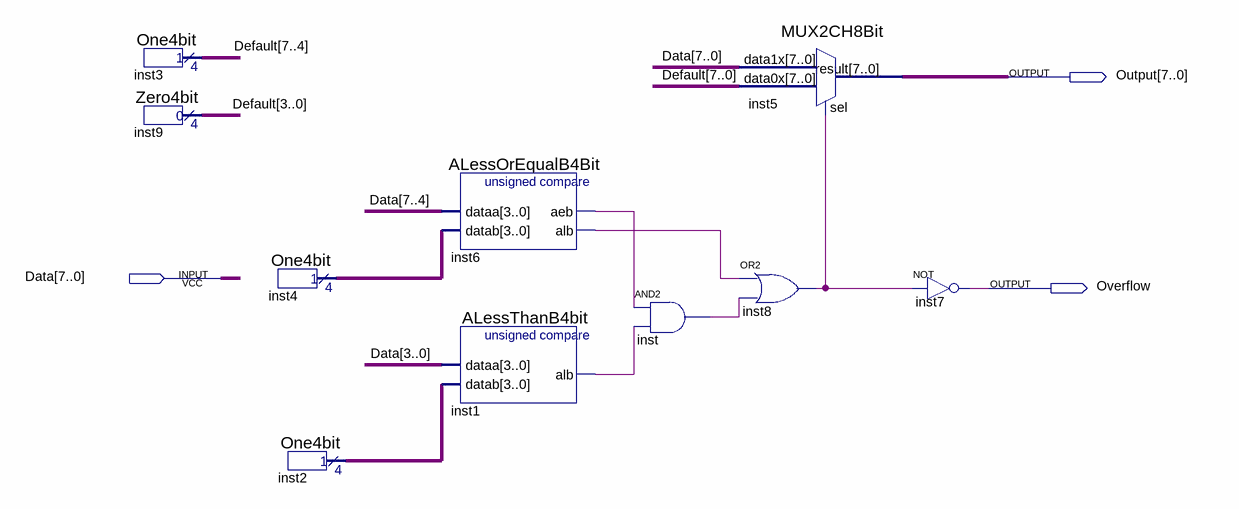
[diagram p0: schematic sheet]
// Quartus schematic FireValueLimit.bdf as structural Verilog: 10 symbols, 3 pins
module FireValueLimit (
  input  [7:0] Data,
  output [7:0] Output,
  output Overflow
);

  wire inst1_alb, inst6_aeb, inst6_alb, inst8_out, inst_out;
  wire [3:0] inst2_result, inst4_result;
  wire [7:0] Default;

  One4bit inst3 (.result(Default[7:4]));
  Zero4bit inst9 (.result(Default[3:0]));
  One4bit inst4 (.result(inst4_result));
  One4bit inst2 (.result(inst2_result));
  ALessOrEqualB4Bit inst6 (.dataa(Data[7:4]), .datab(inst4_result), .aeb(inst6_aeb), .alb(inst6_alb));
  ALessThanB4bit inst1 (.dataa(Data[3:0]), .datab(inst2_result), .alb(inst1_alb));
  and inst (inst_out, inst6_aeb, inst1_alb);
  MUX2CH8Bit inst5 (.data1x(Data), .data0x(Default), .sel(inst8_out), .result(Output));
  or inst8 (inst8_out, inst6_alb, inst_out);
  not inst7 (Overflow, inst8_out);
endmodule
